# EAGLE design untitled (EAGLE 6.5.0)
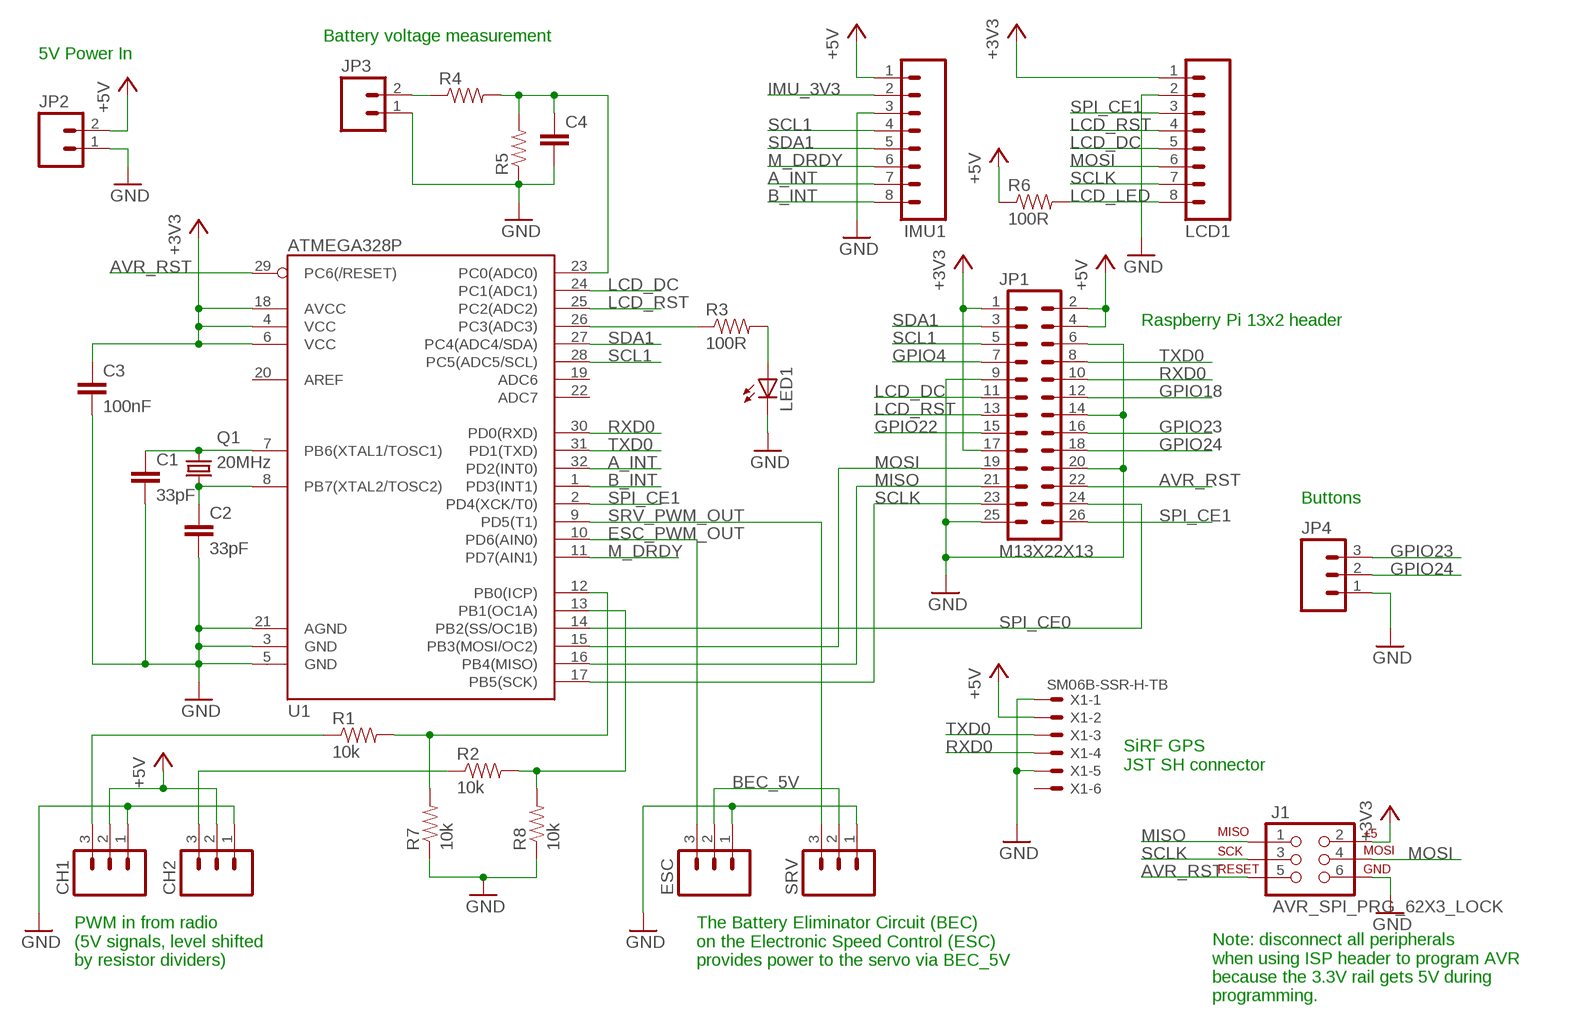
[diagram p0: schematic, sheet 1]

## Parts
C1  33pF  CAP0805  [0805]
C2  33pF  CAP0805  [0805]
C3  100nF  CAP0805  [0805]
C4  CAP0805  [0805]
CH1  M03LOCK  [1X03_LOCK]
CH2  M03LOCK  [1X03_LOCK]
ESC  M03LOCK  [1X03_LOCK]
IMU1  M08LOCK  [1X08_LOCK]
J1  AVR_SPI_PRG_62X3_LOCK  [2X3_LOCK]
JP1  M13X22X13  [2X13]
JP2  M02POLAR_LOCK  [MOLEX-1X2_LOCK]
JP3  M02POLAR_LOCK  [MOLEX-1X2_LOCK]
JP4  M03POLAR_LOCK  [MOLEX-1X3_LOCK]
LCD1  M08LOCK  [1X08_LOCK]
LED1  LED3MM  [LED3MM]
Q1  20MHz  CRYSTALSM49  [SM49]
R1  10k  RESISTOR0805-RES  [0805]
R2  10k  RESISTOR0805-RES  [0805]
R3  100R  RESISTOR0805-RES  [0805]
R4  RESISTOR0805-RES  [0805]
R5  RESISTOR0805-RES  [0805]
R6  100R  RESISTOR0805-RES  [0805]
R7  10k  RESISTOR0805-RES  [0805]
R8  10k  RESISTOR0805-RES  [0805]
SRV  M03LOCK  [1X03_LOCK]
U1  ATMEGA328P  ATMEGA328_SMT  [TQFP32-08]
X1  SM06B-SSR-H-TB  [SM06B-SSR-H-TB]

## Nets
+3V3 [High Current]: C3.1 J1.2 JP1.1 JP1.17 LCD1.1 U1.4(VCC) U1.6(VCC) U1.18(AVCC)
+5V [High Current]: CH1.2 CH2.2 IMU1.1 JP1.2 JP1.4 JP2.2 R6.1 X1.2
A_INT: IMU1.7 U1.32(PD2(INT0))
AVR_RST: J1.5 JP1.22 U1.29(PC6(/RESET))
B_INT: IMU1.8 U1.1(PD3(INT1))
BEC_5V [High Current]: ESC.2 SRV.2
ESC_PWM_OUT: ESC.3 U1.10(PD6(AIN0))
GND [High Current]: C1.2 C2.2 C3.2 C4.2 CH1.1 CH2.1 ESC.1 IMU1.3 J1.6 JP1.6 JP1.9 JP1.14 JP1.20 JP1.25 JP2.1 JP3.1 JP4.1 LCD1.2 LED1.K(C) R5.1 R7.1 R8.1 SRV.1 U1.3(GND) U1.5(GND) U1.21(AGND) X1.1 X1.5
GPIO4: JP1.7
GPIO18: JP1.12
GPIO22: JP1.15
GPIO23: JP1.16 JP4.3
GPIO24: JP1.18 JP4.2
IMU_3V3: IMU1.2
LCD_DC: JP1.11 LCD1.5 U1.24(PC1(ADC1))
LCD_LED: LCD1.8 R6.2
LCD_RST: JP1.13 LCD1.4 U1.25(PC2(ADC2))
M_DRDY: IMU1.6 U1.11(PD7(AIN1))
MISO: J1.1 JP1.21 U1.16(PB4(MISO))
MOSI: J1.4 JP1.19 LCD1.6 U1.15(PB3(MOSI/OC2))
N$1: C1.1 Q1.1 U1.7(PB6(XTAL1/TOSC1))
N$2: C2.1 Q1.2 U1.8(PB7(XTAL2/TOSC2))
N$3: R3.1 U1.26(PC3(ADC3))
N$4: R1.2 R7.2 U1.12(PB0(ICP))
N$5: R2.2 R8.2 U1.13(PB1(OC1A))
N$6: CH1.3 R1.1
N$8: CH2.3 R2.1
N$10: LED1.A R3.2
N$11: JP3.2 R4.1
N$12: C4.1 R4.2 R5.2 U1.23(PC0(ADC0))
RXD0: JP1.10 U1.30(PD0(RXD)) X1.4
SCL1: IMU1.4 JP1.5 U1.28(PC5(ADC5/SCL))
SCLK: J1.3 JP1.23 LCD1.7 U1.17(PB5(SCK))
SDA1: IMU1.5 JP1.3 U1.27(PC4(ADC4/SDA))
SPI_CE0: JP1.24 U1.14(PB2(SS/OC1B))
SPI_CE1: JP1.26 LCD1.3 U1.2(PD4(XCK/T0))
SRV_PWM_OUT: SRV.3 U1.9(PD5(T1))
TXD0: JP1.8 U1.31(PD1(TXD)) X1.3
Unconnected: U1.19(ADC6) U1.20(AREF) U1.22(ADC7) X1.6

## Notes on the sheet
- Battery voltage measurement
- 5V Power In
- Raspberry Pi 13x2 header
- Buttons
- SiRF GPS
  JST SH connector
- PWM in from radio
  (5V signals, level shifted
  by resistor dividers)
- The Battery Eliminator Circuit (BEC)
  on the Electronic Speed Control (ESC)
  provides power to the servo via BEC_5V
- Note: disconnect all peripherals
  when using ISP header to program AVR
  because the 3.3V rail gets 5V during
  programming.

## Library data of the parts
C1 C2 C4 = SparkFun-Capacitors:CAP: Capacitor Standard 0603 ceramic capacitor, and 0.1" leaded capacitor.
C3 = SparkFun-Passives:CAP: Capacitor Standard 0603 ceramic capacitor, and 0.1" leaded capacitor.
CH1 CH2 ESC JP4 SRV = SparkFun-Connectors:M03: Header 3 Standard 3-pin 0.1" header. Use with straight break away headers (SKU : PRT-00116), right angle break away headers (PRT-00553), swiss pins (PRT-00743), machine pins (PRT-00117), and female headers (PRT-00115). Molex polarized connector foot print use with SKU : PRT-08232 with associated crimp pins and housings.
IMU1 LCD1 = SparkFun-Connectors:M08: Header 8 Standard 8-pin 0.1" header. Use with straight break away headers (SKU : PRT-00116), right angle break away headers (PRT-00553), swiss pins (PRT-00743), machine pins (PRT-00117), and female headers (PRT-00115).
J1 = SparkFun-Connectors:AVR_SPI_PRG_6: AVR ISP 6 Pin This is the reduced ISP connector for AVR programming. Common on Arduino. This footprint will take up less PCB space and can be used with a 10-pin to 6-pin adapter such as SKU: BOB-08508
JP1 = SparkFun-Connectors:M13X2: 0.1" spaced headers
JP2 JP3 = SparkFun-Connectors:M02: Header 2 Standard 2-pin 0.1" header. Use with straight break away headers (SKU : PRT-00116), right angle break away headers (PRT-00553), swiss pins (PRT-00743), machine pins (PRT-00117), and female headers (PRT-00115). Molex polarized connector foot print use with SKU : PRT-08233 with associated crimp pins and housings.
LED1 = SparkFun-LED:LED: LEDs Standard schematic elements and footprints for 5mm, 3mm, 1206, and 0603 sized LEDs. 5mm - Spark Fun Electronics SKU : COM-00529 (and others)
Q1 = crystal:CRYSTAL: CRYSTAL; OC_FARNELL: unknown; OC_NEWARK: unknown
R1-R8 = SparkFun-Resistors:RESISTOR: Resistor Basic schematic elements and footprints for 0603, 1206, and PTH resistors.
U1 = SparkFun-DigitalIC:ATMEGA328_SMT: 32-Pin Atmega328 part Commonly used on Arduino compatible boards Available in QFP and QFN packages TQFP is IC-09069 QFN is non-stock; PROD_ID: IC-09069
X1 = con-jst2:SM06B-SSR-H-TB: Disconnectable Insulation displacement connector, 1.0mm pitch 6 contacts

## Net classes
1 High Current: width 0.406 mm

## Board
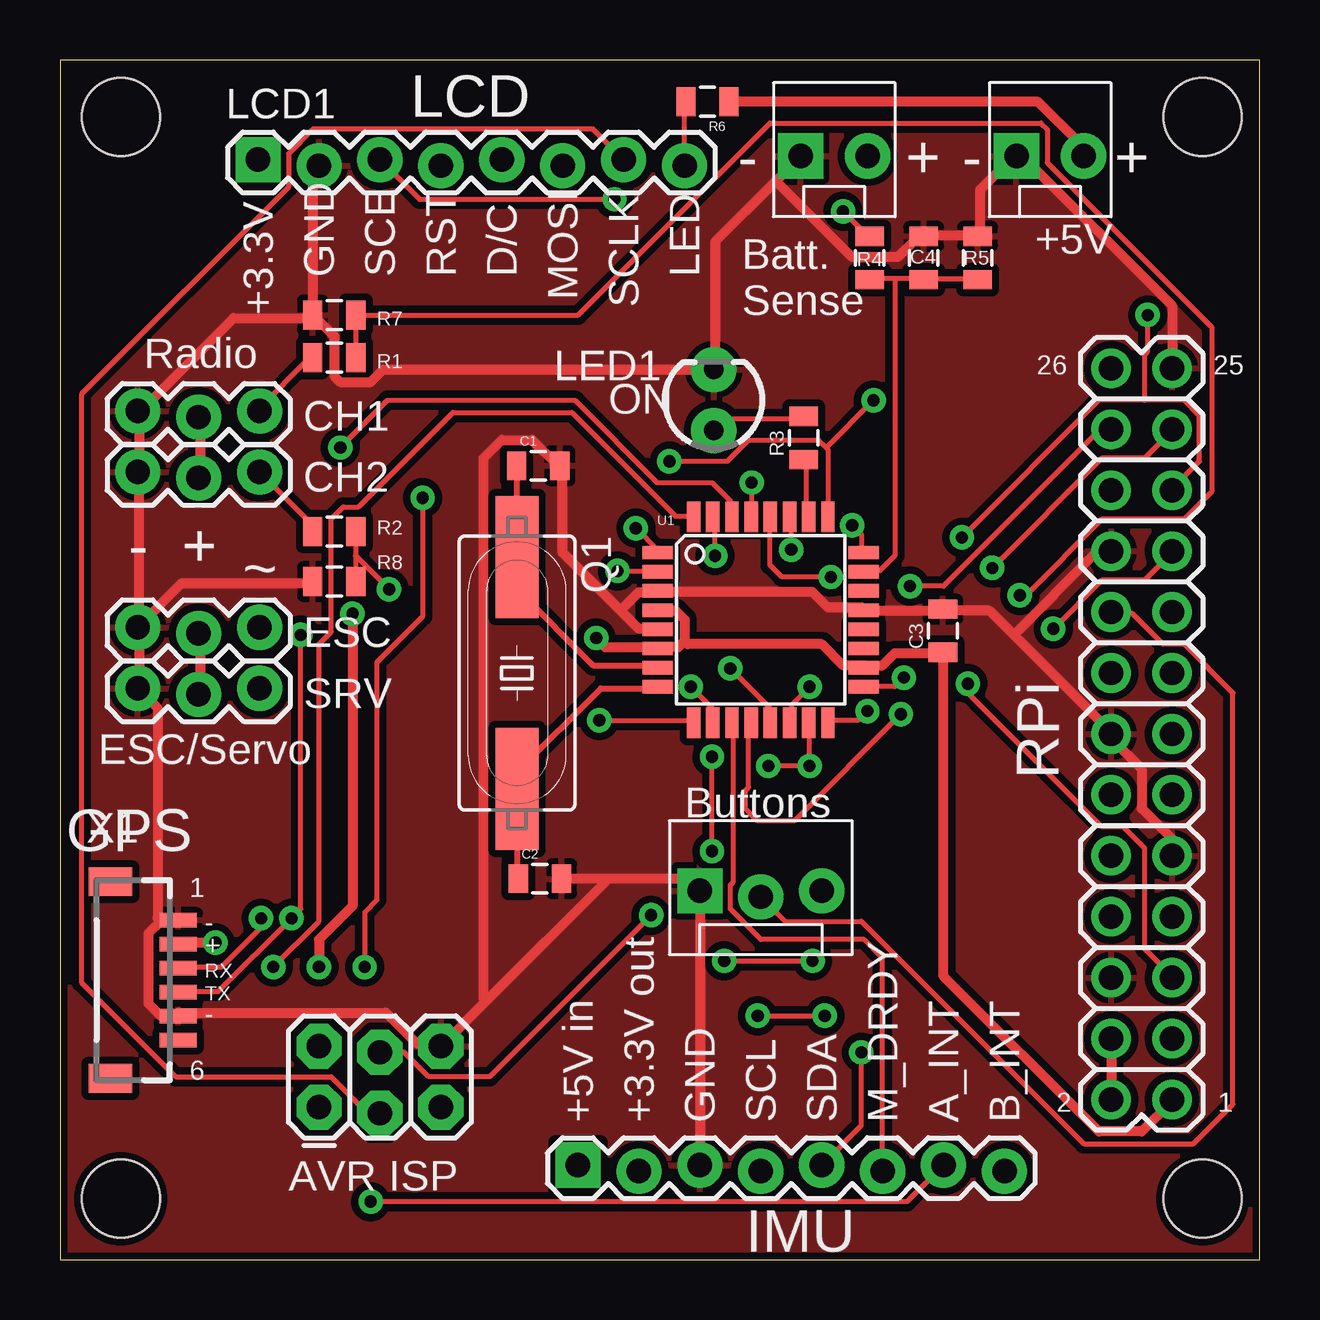
[diagram p1: board, top side]
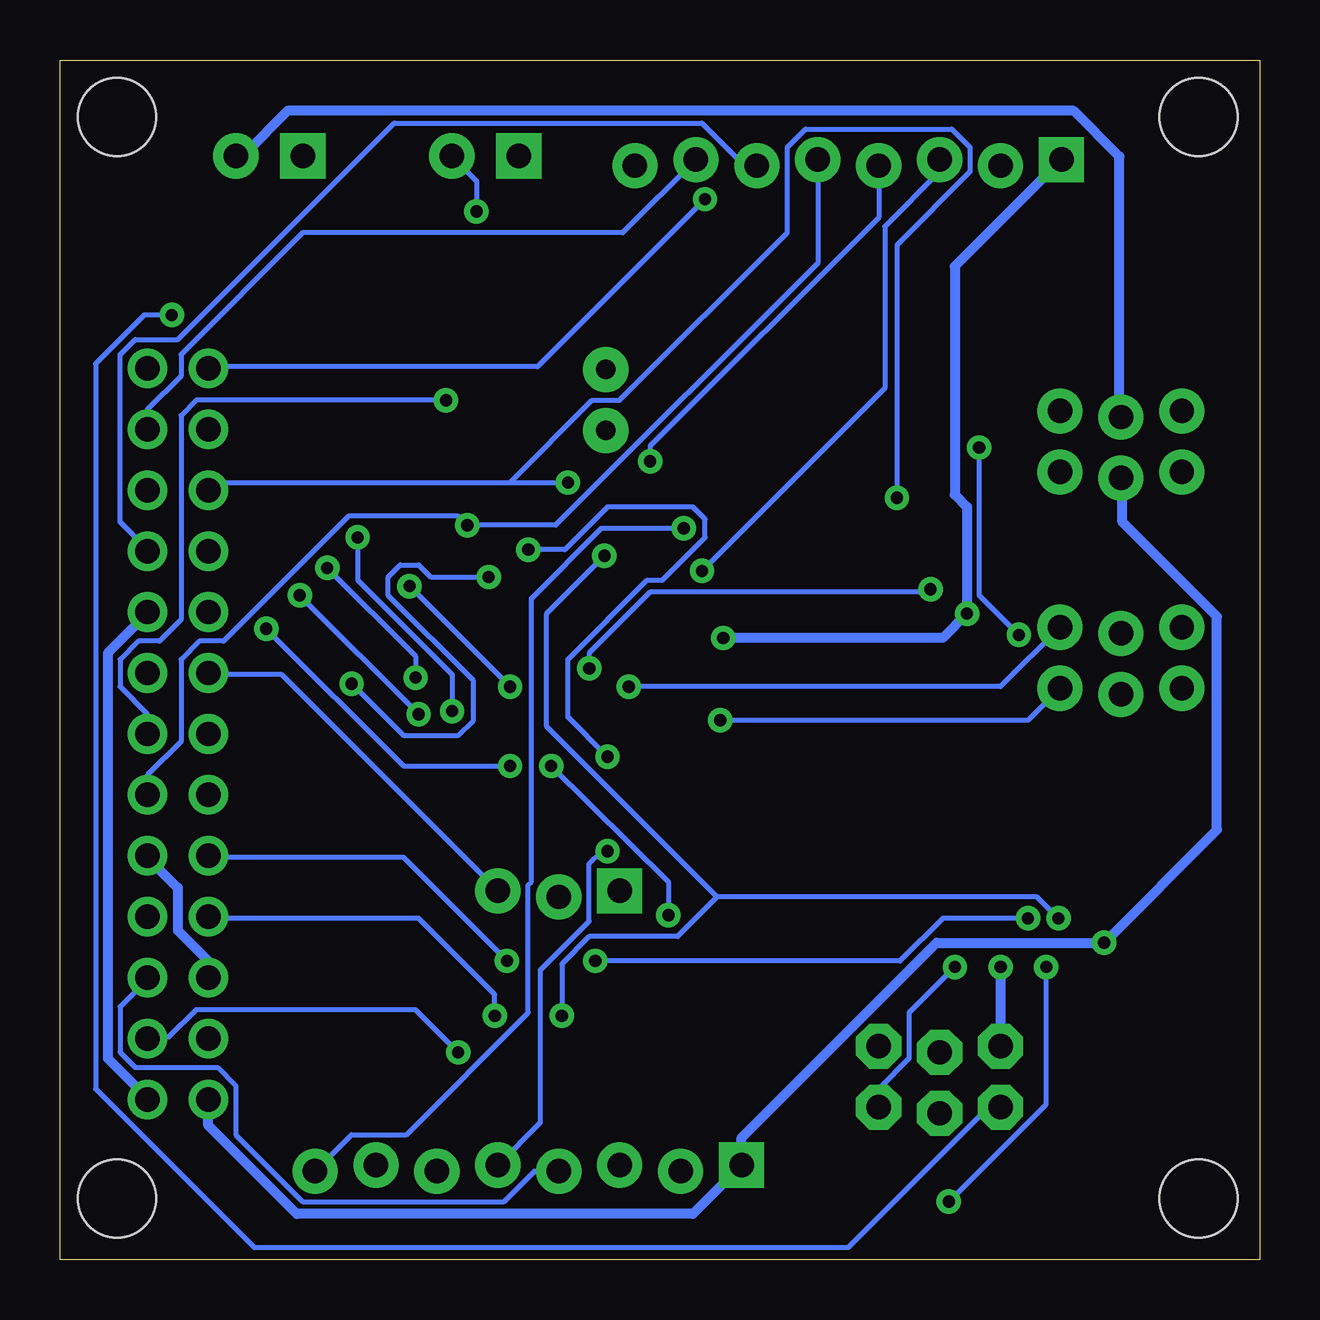
[diagram p2: board, bottom side, seen from below]

Size 50 x 50 mm. Coordinates in mm from the lower left corner, seen from the top.
Outline: 0,0 50,0 50,50 0,50 0,0
Copper layers (1*16): Top 0.035mm / dielectric 1.5mm / Bottom 0.035mm
Design rules "SparkFun": minimum track width 8mil, minimum drill 20mil, track to track 8mil, track to pad 8mil, pad to pad 8mil, via to via 8mil, smd to smd 8mil, copper to edge 10mil, drill to drill 8mil, minimum pad ring 12mil, minimum via ring 10mil, stop-mask expansion 4mil, vias tented up to drill 25mil, thermal gap 10mil
Holes 3.26 mm at 47.62,47.62 47.62,2.54 2.54,2.54 2.54,47.62

### Footprints (pad centres in the part's own frame; a part is rotated, then mirrored left to right if it is on the bottom)
0805 = smd 0.8 x 1.2: 1 -0.9,0; 2 0.9,0
1X03_LOCK = drill 1.016 pad 1.88: 1 0,0.127; 2 2.54,-0.127; 3 5.08,0.127
1X08_LOCK = drill 1.016 pad 1.88 square: 1 0,0.127 | drill 1.016 pad 1.88: 2 2.54,-0.127; 3 5.08,0.127; 4 7.62,-0.127; 5 10.16,0.127; 6 12.7,-0.127; 7 15.24,0.127; 8 17.78,-0.127
2X3_LOCK = drill 1.016 pad 1.88 octagon: 1 0,0; 2 0,2.54; 3 2.54,-0.254; 4 2.54,2.286; 5 5.08,0; 6 5.08,2.54
2X13 = drill 1.016 pad 1.651: 1 0,0; 2 0,2.54; 3 2.54,0; 4 2.54,2.54; 5 5.08,0; 6 5.08,2.54; 7 7.62,0; 8 7.62,2.54; 9 10.16,0; 10 10.16,2.54; 11 12.7,0; 12 12.7,2.54; 13 15.24,0; 14 15.24,2.54; 15 17.78,0; 16 17.78,2.54; 17 20.32,0; 18 20.32,2.54; 19 22.86,0; 20 22.86,2.54; 21 25.4,0; 22 25.4,2.54; 23 27.94,0; 24 27.94,2.54; 25 30.48,0; 26 30.48,2.54
MOLEX-1X2_LOCK = drill 1.016 pad 1.88 square: 1 -0.127,0 | drill 1.016 pad 1.88: 2 2.667,0
MOLEX-1X3_LOCK = drill 1.016 pad 1.88 square: 1 0,0.127 | drill 1.016 pad 1.88: 2 2.54,-0.127; 3 5.08,0.127
LED3MM = drill 0.813 pad 1.88: A -1.27,0; K 1.27,0
SM49 = smd 5.08 x 1.778: 1 -4.826,0; 2 4.826,0
TQFP32-08 = smd 1.27 x 0.559: 1 -4.293,2.8; 2 -4.293,2; 3 -4.293,1.2; 4 -4.293,0.4; 5 -4.293,-0.4; 6 -4.293,-1.2; 7 -4.293,-2; 8 -4.293,-2.8; 17 4.293,-2.8; 18 4.293,-2; 19 4.293,-1.2; 20 4.293,-0.4; 21 4.293,0.4; 22 4.293,1.2; 23 4.293,2; 24 4.293,2.8 | smd 0.559 x 1.27: 9 -2.8,-4.293; 10 -2,-4.293; 11 -1.2,-4.293; 12 -0.4,-4.293; 13 0.4,-4.293; 14 1.2,-4.293; 15 2,-4.293; 16 2.8,-4.293; 25 2.8,4.293; 26 2,4.293; 27 1.2,4.293; 28 0.4,4.293; 29 -0.4,4.293; 30 -1.2,4.293; 31 -2,4.293; 32 -2.8,4.293
SM06B-SSR-H-TB = smd 0.6 x 1.55: 1 -2.5,1.925; 2 -1.5,1.925; 3 -0.5,1.925; 4 0.5,1.925; 5 1.5,1.925; 6 2.5,1.925 | smd 1.2 x 1.8: FIT@1 -4.1,-0.9; FIT@2 4.1,-0.9

### Placement (x,y rotation side)
C1  19.93,33.09 0 top
C2  20,15.88 0 top
C3  36.8,26.21 90 top
C4  36,41.75 90 top
CH1  3.24,35.24 0 top
CH2  3.24,32.7 0 top
ESC  3.24,26.23 0 top
IMU1  21.59,3.81 0 top
J1  10.79,6.35 0 top
JP1  46.35,6.67 90 top
JP2  40,46 0 top
JP3  31,46 0 top
JP4  26.67,15.24 0 top
LCD1  8.26,45.72 0 top
LED1  27.25,35.83 90 top
Q1  19.05,24.45 270 top
R1  11.43,37.59 0 top
R2  11.43,30.34 0 top
R3  31,34.25 90 top
R4  33.75,41.75 270 top
R5  38.25,41.75 270 top
R6  26.99,48.26 180 top
R7  11.43,39.37 0 top
R8  11.43,28.26 0 top
SRV  3.24,23.69 0 top
U1  29.21,26.67 0 top
X1  3,11.65 270 top

### Tracks (layer width: path | path; a pad name or v marks a point on that pad's centre or on a via)
+3V3  (via drill 0.51)
  Top 0.406: 26.04,25.78 25.78,25.53 25.02,25.53 U1.6 24.77,25.53 22.73,25.53 v22.35,25.91 | 26.04,25.78 26.04,26.67 25.65,27.05 25.02,27.05 U1.4 | 26.04,25.78 26.16,25.65 31.75,25.65 32.64,24.77 33.4,24.77 U1.18 33.53,24.77 34.29,24.77 34.8,25.27 36.7,25.27 C3.1 36.83,25.15 36.83,11.81 43.31,5.33 45.09,5.33 46.35,6.6 JP1.1 | v10.79,12.19 10.79,13.34 12.19,14.73 v12.19,26.92
  Bottom 0.406: JP1.1 46.35,6.73 48.01,8.38 48.01,25.27 46.35,26.92 JP1.17 | v10.79,12.19 J1.2 | LCD1.1 12.7,41.4 12.7,31.88 12.19,31.37 v12.19,26.92 13.21,25.91 v22.35,25.91
+5V  (via drill 0.51)
  Top 0.406: R6.1 40.77,48.26 42.55,46.48 42.55,46.1 JP2.2 | CH2.2 5.84,32.64 5.84,35.05 CH1.2 | JP1.4 JP1.2 | v6.48,13.21 4.95,13.21 X1.2
  Bottom 0.406: JP1.2 43.81,5.59 40.13,1.91 23.62,1.91 IMU1.1 21.59,5.08 13.46,13.21 v6.48,13.21 1.78,17.91 1.78,26.8 5.71,30.73 5.71,32.51 CH2.2 | JP2.2 42.55,46.1 42.29,46.1 40.51,47.88 7.75,47.88 5.84,45.97 5.84,35.18 CH1.2
A_INT  (via drill 0.51)
  Top 0.203: v8.89,12.19 10.79,14.1 10.79,25.65 11.3,26.16 11.3,30.86 11.81,31.37 12.45,31.37 16.38,35.31 21.34,35.31 25.65,30.99 26.29,30.99 U1.32 | v12.95,2.41 35.31,2.41 IMU1.7
  Bottom 0.203: v8.89,12.19 8.89,6.48 v12.95,2.41
AVR_RST  (via drill 0.51)
  Top 0.203: v28.83,32.38 28.83,30.99 U1.29 | v12.7,12.19 12.7,14.48 13.21,14.99 13.21,24.89 15.11,26.8 v15.11,31.75
  Bottom 0.203: 31.24,32.38 43.56,32.38 43.81,32.13 JP1.22 | 31.24,32.38 v28.83,32.38 | J1.5 15.88,7.11 14.61,8.38 14.61,10.29 v12.7,12.19 | v15.11,31.75 15.11,42.29 12.06,45.34 12.06,46.35 12.83,47.12 18.92,47.12 19.68,46.35 19.68,42.8 26.67,35.81 27.81,35.81 31.24,32.38
B_INT  (via drill 0.51)
  Top 0.203: v24,30.48 24.89,29.59 U1.1
  Bottom 0.203: v24,30.48 27.43,30.48 30.35,27.56 30.35,15.75 30.48,15.62 30.48,10.29 35.56,5.21 37.85,5.21 IMU1.8
BEC_5V
  Top 0.406: SRV.2 5.84,23.62 5.84,26.04 ESC.2
ESC_PWM_OUT  (via drill 0.51)
  Top 0.203: v26.29,23.88 27.18,22.99 27.18,22.48 U1.10
  Bottom 0.203: v26.29,23.88 10.79,23.88 ESC.3
GND
  Top 0.406: 23.37,27.05 24.13,26.29 24.89,26.29 U1.5 | 23.37,27.05 20.95,29.46 20.95,33.02 C1.2 20.7,33.15 19.68,34.16 18.41,34.16 17.65,33.4 17.65,10.92 17.78,10.79 | 23.37,27.05 24.13,27.81 24.89,27.81 U1.3 25.02,27.81 31.37,27.81 32,27.18 33.4,27.18 U1.21 33.53,27.05 36.7,27.05 C3.2 36.96,27.05 38.73,27.05 39.75,26.04 | 39.75,26.04 43.81,21.97 JP1.14 43.81,21.72 45.09,20.45 45.09,18.8 46.35,17.53 JP1.9 | 39.75,26.04 43.18,29.46 43.81,29.46 JP1.20 | 29.84,44.96 30.86,45.97 JP3.1 | 29.84,44.96 27.3,42.42 27.3,37.21 LED1.K 27.05,37.08 13.46,37.08 12.95,36.58 11.68,36.58 11.43,36.83 11.43,38.48 10.67,39.24 R7.1 | JP1.25 46.35,39.75 40.01,46.1 JP2.1 39.75,45.97 38.35,44.58 38.35,42.8 R5.1 38.23,42.67 36.07,42.67 C4.2 35.81,42.67 34.92,41.78 33.02,41.78 29.84,44.96 | 22.73,15.88 26.16,15.88 JP4.1 IMU1.3 | 22.73,15.88 C2.2 | 17.78,10.79 22.73,15.75 22.73,15.88 | 17.78,10.79 J1.6 15.75,9.02 14.86,9.02 13.59,10.29 4.95,10.29 X1.5 4.83,10.16 4.19,10.16 3.68,10.67 3.68,13.59 4.19,14.1 | 4.19,14.1 4.83,14.1 X1.1 | 4.19,14.1 4.06,14.22 4.06,22.99 SRV.1 3.3,24 3.3,26.16 ESC.1 | LCD1.2 10.54,45.34 10.54,39.37 R7.1 | ESC.1 5.08,28.19 10.41,28.19 R8.1 | ESC.1 3.3,26.67 3.3,32.64 CH2.1 3.3,32.89 3.3,35.31 CH1.1 3.43,35.43 7.24,39.24 10.41,39.24 R7.1
  Bottom 0.406: JP1.6 43.81,12.45 45.09,13.72 45.09,15.49 46.35,16.76 JP1.9
  pour Top (isolate 0.305): 0.32,0.32 49.85,0.32 49.85,49.85 0,49.85 0,0.32
GPIO23
  Bottom 0.203: JP4.3 40.77,24.38 43.81,24.38 JP1.16
GPIO24
  Top 0.203: JP4.2 30.23,14.1 33.4,14.1 42.67,4.83 47.24,4.83 48.9,6.48 48.9,23.62 46.86,25.65 45.97,25.65 44.7,26.92 43.81,26.92 JP1.18
LCD_DC  (via drill 0.51)
  Top 0.203: v33.02,30.61 33.4,30.23 33.4,29.59 U1.24
  Bottom 0.203: LCD1.5 18.41,41.53 29.34,30.61 v33.02,30.61 33.4,30.99 37.97,30.99 43.18,25.78 44.2,25.78 44.96,25.02 44.96,21.59 46.35,20.19 JP1.11
LCD_LED
  Top 0.203: LCD1.8 26.04,48.26 R6.2
LCD_RST  (via drill 0.51)
  Top 0.203: 31.94,33.85 31.62,34.16 28.7,34.16 27.81,33.27 v25.4,33.27 | 31.94,33.85 32,33.78 32,30.99 U1.25 | 31.94,33.85 v33.91,35.81
  Bottom 0.203: v25.4,33.27 25.4,33.91 15.88,43.43 LCD1.4 | JP1.13 46.35,22.73 47.5,23.88 47.5,25.02 46.74,25.78 45.85,25.78 44.96,26.67 44.96,35.18 44.32,35.81 v33.91,35.81
M_DRDY
  Top 0.203: IMU1.6 34.29,12.57 33.53,13.34 29.21,13.34 27.94,14.61 27.94,15.62 28.07,15.75 28.07,22.35 U1.11
MISO  (via drill 0.51)
  Top 0.203: v33.66,22.86 33.27,22.48 32.13,22.48 U1.16 | v37.59,30.1 43.31,35.81 45.21,35.81 | 45.21,35.81 46.86,35.81 47.5,35.18 47.5,33.27 46.35,32.13 JP1.21 | v45.34,39.37 45.34,37.85 45.21,37.72 45.21,35.81
  Bottom 0.203: v33.66,22.86 33.66,24.38 37.59,28.32 v37.59,30.1 | J1.1 11.3,6.35 17.14,0.51 41.91,0.51 48.51,7.11 48.51,37.34 46.48,39.37 v45.34,39.37
MOSI  (via drill 0.51)
  Top 0.203: v41.4,26.29 43.43,28.32 45.21,28.32 46.35,29.46 JP1.19 | U1.15 31.24,22.35 v31.24,20.57 v29.53,20.57 | J1.4 14.35,8.64 15.37,7.62 17.91,7.62 v24.64,14.35
  Bottom 0.203: v31.24,20.57 35.69,20.57 v41.4,26.29 | v24.64,14.35 24.64,15.75 v29.53,20.57 | LCD1.6 21.46,45.59 23.24,47.37 36.07,47.37 45.09,38.35 46.86,38.35 47.5,37.72 47.5,30.73 46.35,29.59 JP1.19
N$1
  Top 0.254: C1.1 19.05,33.07 Q1.1 19.05,27.94 22.23,24.77 24.82,24.77 U1.7
N$2
  Top 0.254: U1.8 24.86,23.81 22.54,23.81 19.05,20.32 Q1.2 19.05,15.93 C2.1
N$3
  Top 0.203: R3.1 31.11,33.27 31.11,30.99 U1.26
N$4  (via drill 0.51)
  Top 0.203: R1.2 12.32,37.72 R7.2 21.59,39.37 29.59,47.37 40.89,47.37 41.15,47.12 41.15,45.72 48.01,38.86 48.01,32 46.86,30.86 43.43,30.86 40.26,27.69 v40.01,27.69 | v35.05,22.73 30.61,18.29 29.08,18.29 28.57,18.8 28.57,19.56 28.7,19.68 28.7,22.35 U1.12
  Bottom 0.203: v40.01,27.69 v35.05,22.73
N$5  (via drill 0.51)
  Top 0.203: 12.32,29.34 12.32,30.23 R2.2 | 12.32,29.34 12.32,28.32 R8.2 | v27.94,24.64 29.59,22.99 29.59,22.48 U1.13 | 12.32,29.34 v13.72,27.94
  Bottom 0.203: v27.94,24.64 27.94,25.27 25.4,27.81 13.84,27.81 v13.72,27.94
N$6
  Top 0.203: R1.1 10.41,37.59 8.26,35.43 CH1.3
N$8
  Top 0.203: CH2.3 10.41,30.73 10.41,30.35 R2.1
N$10
  Top 0.203: R3.2 30.99,35.05 27.69,35.05 27.3,34.67 LED1.A
N$11  (via drill 0.51)
  Top 0.203: v32.64,43.69 33.66,42.67 R4.1
  Bottom 0.203: v32.64,43.69 32.64,44.96 33.66,45.97 JP3.2
N$12
  Top 0.203: 34.8,40.89 35.94,40.89 C4.1 36.07,40.89 38.23,40.89 R5.2 | 34.8,40.89 33.78,40.89 R4.2 | 34.8,40.89 34.8,29.34 34.16,28.7 33.53,28.7 U1.23
RXD0  (via drill 0.51)
  Top 0.203: v11.68,33.85 13.65,35.81 21.46,35.81 24.89,32.38 27.18,32.38 27.94,31.62 27.94,30.99 U1.30 | v10.03,26.04 10.03,14.61 v9.65,14.22 6.6,11.18 4.95,11.18 X1.4 | v27.69,12.45 v31.37,12.45
  Bottom 0.203: v11.68,33.85 11.68,27.69 v10.03,26.04 | v31.37,12.45 35.69,16.76 43.81,16.76 JP1.10 | v27.69,12.45 14.99,12.45 13.21,14.22 v9.65,14.22
SCL1  (via drill 0.51)
  Top 0.203: v32.13,28.45 30.1,28.45 29.59,28.96 29.59,30.86 U1.28 | v37.85,24 37.85,23.62 43.43,18.03 44.32,18.03 45.21,17.14 45.21,12.95 46.35,11.81 JP1.5
  Bottom 0.203: v32.13,28.45 34.54,28.45 35.05,28.96 35.81,28.96 36.32,28.45 36.32,27.69 32.77,24.13 32.77,22.48 33.4,21.84 35.69,21.84 v37.85,24 | IMU1.4 30.23,3.68 31.5,2.41 39.88,2.41 42.67,5.21 42.67,7.24 43.43,8 46.86,8 47.5,8.64 47.5,10.54 46.35,11.68 JP1.5
SCLK  (via drill 0.51)
  Top 0.203: v35.18,24.26 34.8,23.88 33.53,23.88 U1.17 | v38.86,28.83 43.43,33.4 45.21,33.4 46.35,34.54 JP1.23 | J1.3 12.83,6.1 11.3,7.62 4.83,7.62 0.89,11.56 0.89,36.07 9.53,44.7 9.53,46.1 10.54,47.12 22.23,47.12 LCD1.7
  Bottom 0.203: v35.18,24.26 35.18,25.15 v38.86,28.83 | JP1.23 46.35,35.43 44.96,36.83 44.96,37.72 39.88,42.8 26.54,42.8 LCD1.7
SDA1  (via drill 0.51)
  Top 0.203: v30.48,29.59 30.48,30.86 U1.27 | v27.18,17.02 v27.18,20.95 | v33.4,8.64 33.4,5.59 IMU1.5
  Bottom 0.203: v30.48,29.59 28.96,29.59 27.18,31.37 23.62,31.37 23.11,30.86 23.11,30.1 24.89,28.32 25.53,28.32 28.83,25.02 28.83,22.61 v27.18,20.95 | v27.18,17.02 27.43,17.02 27.94,16.51 27.94,14.1 29.97,12.06 29.97,5.71 IMU1.5 | v33.4,8.64 35.18,10.41 44.32,10.41 45.47,9.27 46.35,9.27 JP1.3
SPI_CE0  (via drill 0.51)
  Top 0.203: v31.24,23.88 30.48,23.11 30.48,22.48 U1.14 | v35.43,28.07 36.83,28.07 43.31,34.54 43.81,34.54 JP1.24
  Bottom 0.203: v35.43,28.07 v31.24,23.88
SPI_CE1  (via drill 0.51)
  Top 0.203: v23.24,28.7 24.89,28.7 U1.2 | v23.11,44.2 14.99,44.2 LCD1.3
  Bottom 0.203: v23.24,28.7 15.62,36.32 15.62,43.05 13.34,45.34 LCD1.3 | v23.11,44.2 30.1,37.21 43.81,37.21 JP1.26
SRV_PWM_OUT  (via drill 0.51)
  Top 0.203: v22.48,22.48 26.29,22.48 U1.9
  Bottom 0.203: v22.48,22.48 9.65,22.48 SRV.3
TXD0  (via drill 0.51)
  Top 0.203: v27.3,29.34 27.3,30.86 U1.31 | v8.38,14.22 8.38,13.84 6.73,12.19 4.95,12.19 X1.3 | v29.08,10.16 v31.88,10.16
  Bottom 0.203: v27.3,29.34 29.72,26.92 29.72,22.23 22.61,15.11 | 22.61,15.11 9.27,15.11 v8.38,14.22 | v31.88,10.16 31.88,11.05 35.05,14.22 43.81,14.22 JP1.8 | v29.08,10.16 29.08,12.32 27.94,13.46 24.26,13.46 22.61,15.11

### Text on the board
tPlace: LCD | - | + | - | + | +5V | GND | SCE | RST | D/C | LED | MOSI | SCLK | +3.3V | Batt. / Sense | Radio | 26 | 25 | ON | - | + | ~ | ESC/Servo | RPi | GPS | Buttons | 1 | - | + | RX | TX | - | 6 | +5V in | +3.3V out | GND | SCL | SDA | M_DRDY | A_INT | B_INT | 2 | 1 | AVR ISP | IMU